# Altium schematic sheet ORD_FV1_2.SchDoc
size 420 x 297 mm; Address1: Address1; Address2: Address2; Address3: Address3; Address4: Address4; DocumentNumber: АБВГ.123456.001 Э3; SheetNumber: 1; Scale: 1:1; DocumentType: Схема электрическая принципиальная; FirstReferrence: АБВГ.123456.001
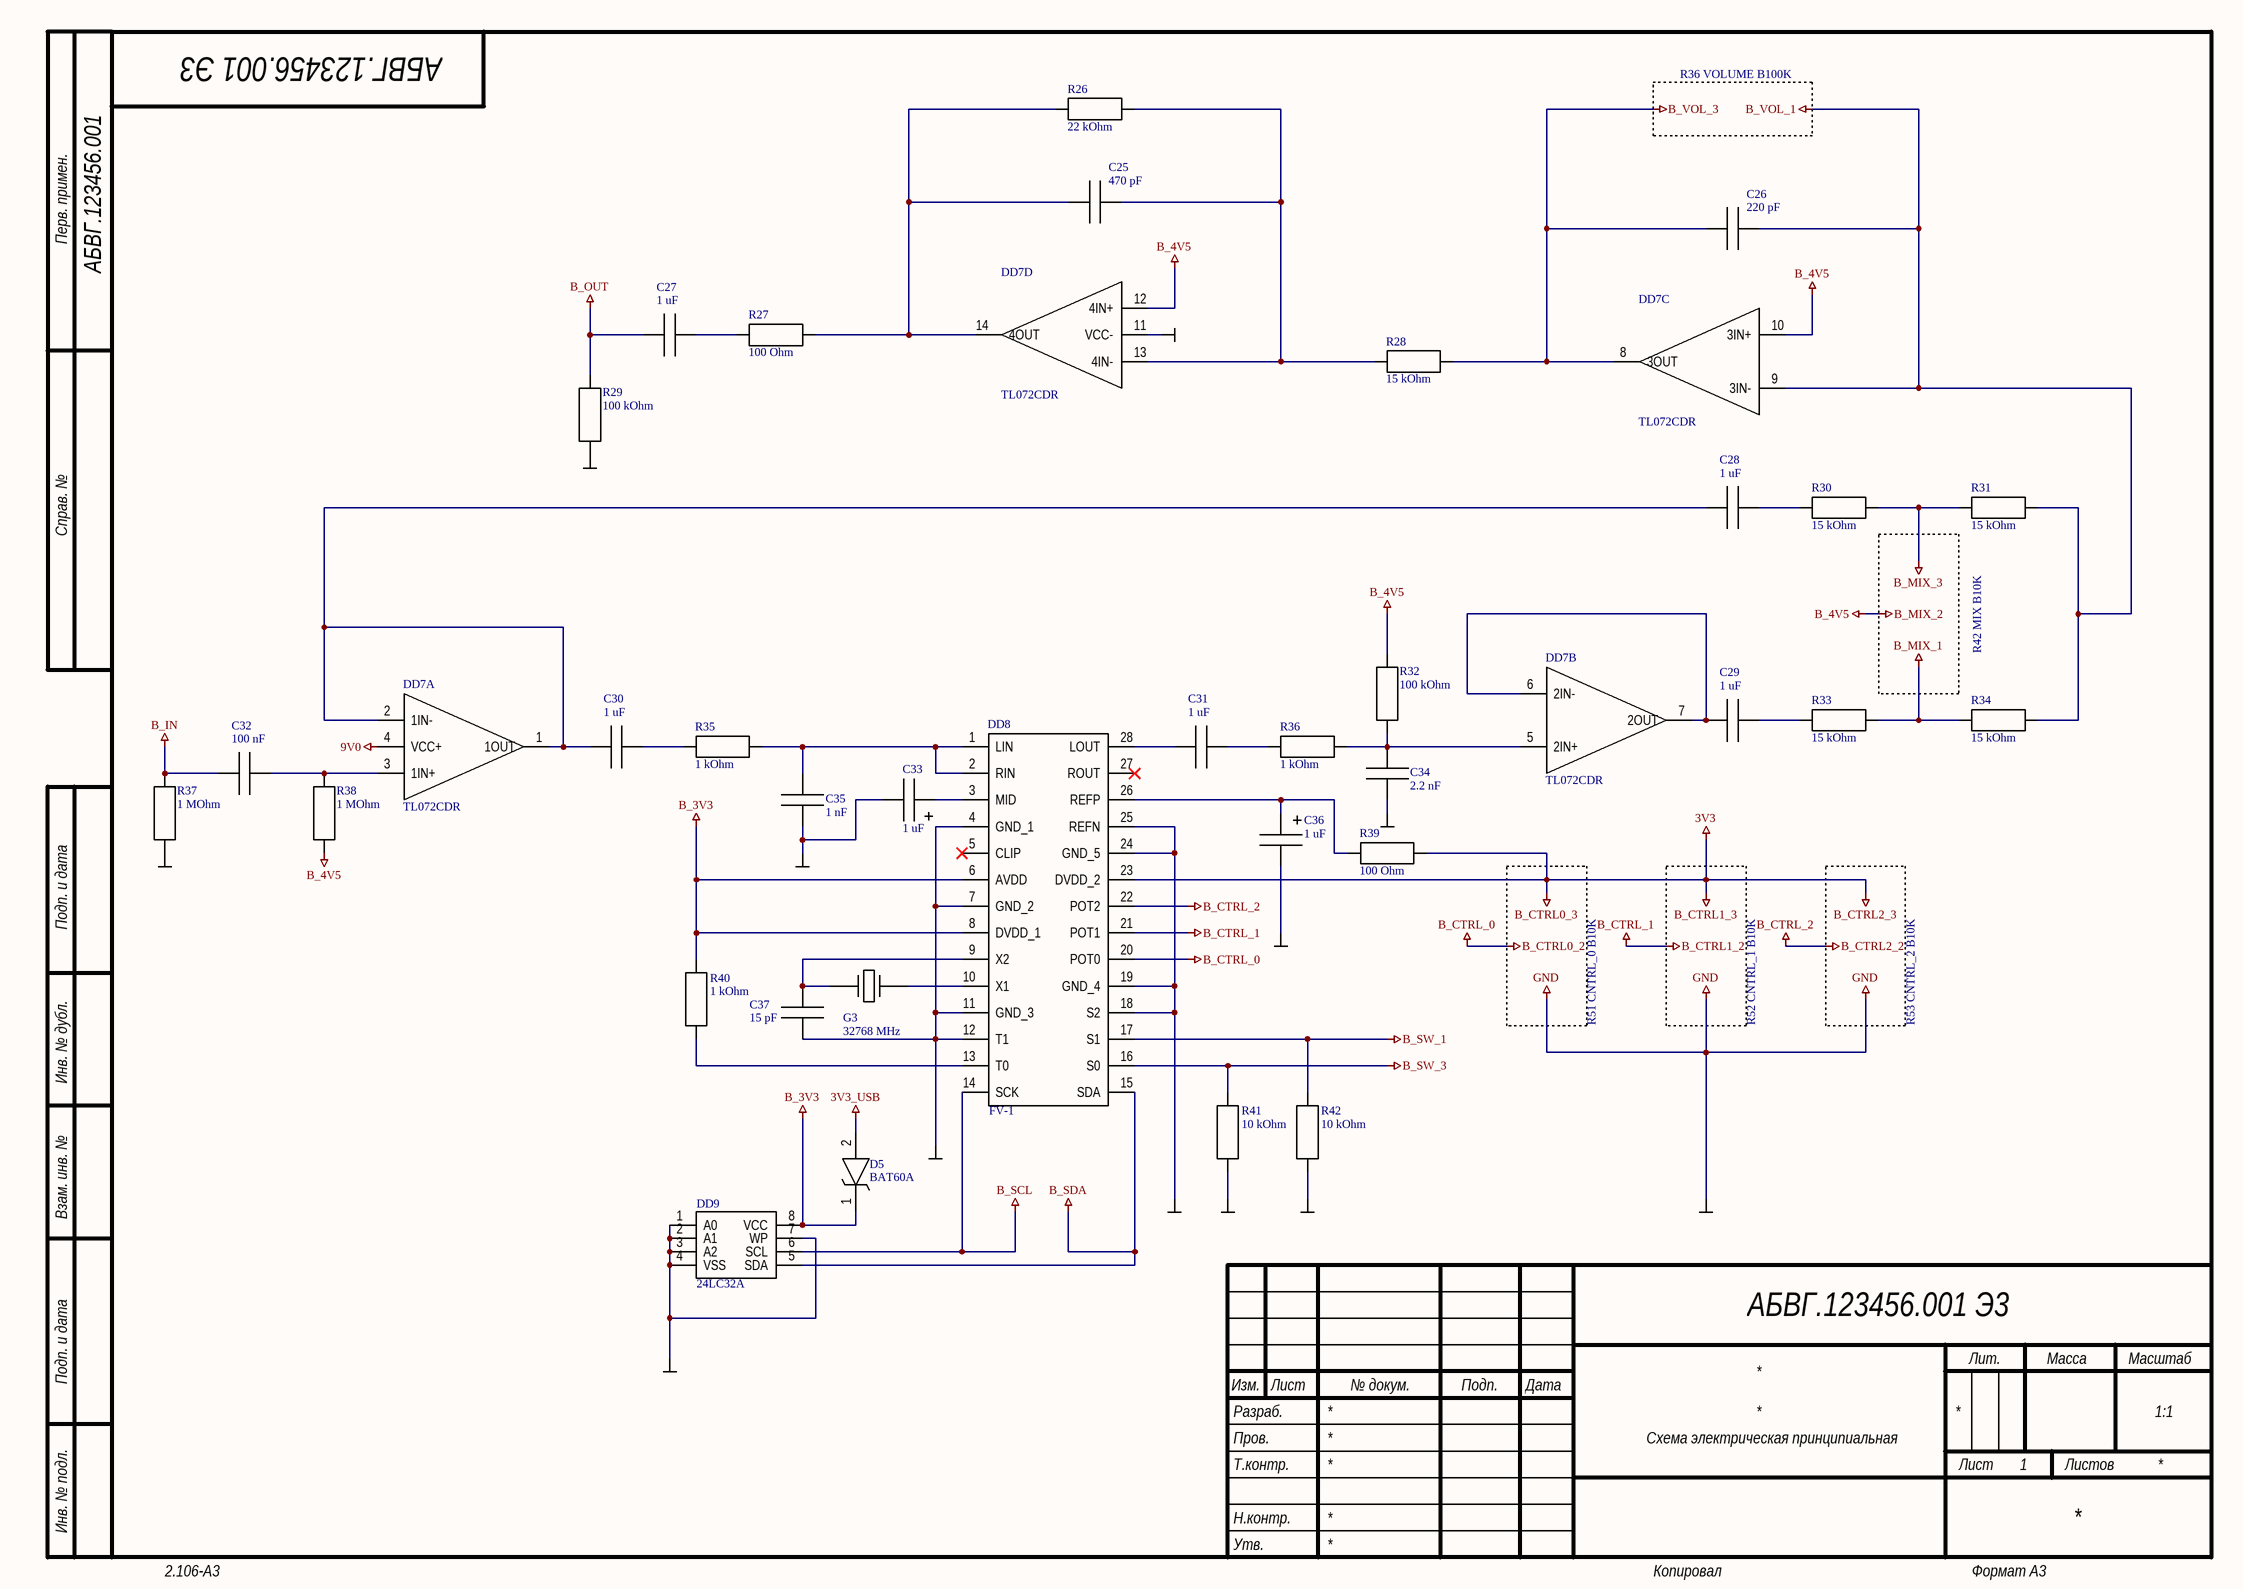
[diagram p0: ORD_FV1_2.SchDoc]

## Parts
C25  470 pF  [C0805[2012]]
C26  220 pF  [C0805[2012]]
C27  1 uF  [C0805[2012]]
C28  1 uF  [C0805[2012]]
C29  1 uF  [C0805[2012]]
C30  1 uF  [C0805[2012]]
C31  1 uF  [C0805[2012]]
C32  100 nF  [C0805[2012]]
C33  1 uF  [C3216_CASE-A]
C34  2.2 nF  [C0805[2012]]
C35  1 nF  [C0805[2012]]
C36  1 uF  [C3216_CASE-A]
C37  15 pF  [C0805[2012]]
D5  BAT60A  [SOD323]
DD7  TL072CDR  [SO14]  (parts A,B,C,D of 4)
DD8  FV-1  [SOIC28]
DD9  24LC32A  [DIP8_WITH_SOCKET]
G3  32768 MHz  [HC-49]
R26  22 kOhm  [R0805[2012]]
R27  100 Ohm  [R0805[2012]]
R28  15 kOhm  [R0805[2012]]
R29  100 kOhm  [R0805[2012]]
R30  15 kOhm  [R0805[2012]]
R31  15 kOhm  [R0805[2012]]
R32  100 kOhm  [R0805[2012]]
R33  15 kOhm  [R0805[2012]]
R34  15 kOhm  [R0805[2012]]
R35  1 kOhm  [R0805[2012]]
R36  1 kOhm  [R0805[2012]]
R37  1 MOhm  [R0805[2012]]
R38  1 MOhm  [R0805[2012]]
R39  100 Ohm  [R0805[2012]]
R40  1 kOhm  [R0805[2012]]
R41  10 kOhm  [R0805[2012]]
R42  10 kOhm  [R0805[2012]]

## Nets
3V3: DD8.23(DVDD_2) R39.1  [also labelled B_CTRL0_3, B_CTRL1_3, B_CTRL2_3]
3V3_USB: D5.2(A)
9V0: DD7.4(VCC+)
B_3V3: D5.1(K) DD8.6(AVDD) DD8.8(DVDD_1) DD9.8(VCC) R40.2
B_4V5: DD7.10(3IN+) DD7.12(4IN+) R32.1 R38.1  [also labelled B_MIX_2]
B_CTRL0_2: DD8.20(POT0)  [also labelled B_CTRL_0]
B_CTRL1_2: DD8.21(POT1)  [also labelled B_CTRL_1]
B_CTRL2_2: DD8.22(POT2)  [also labelled B_CTRL_2]
B_IN: C32.1 R37.2
B_MIX_1: R33.1 R34.2
B_MIX_3: R30.1 R31.2
B_OUT: C27.1 R29.2
B_SCL: DD8.14(SCK) DD9.6(SCL)
B_SDA: DD8.15(SDA) DD9.5(SDA)
B_SW_1: DD8.17(S1) R42.2
B_SW_3: DD8.16(S0) R41.2
B_VOL_1: C26.2 DD7.9(3IN-) R31.1 R34.1
B_VOL_3: C26.1 DD7.8(3OUT) R28.1
GND: C33.2 C34.1 C35.1 C36.2 C37.2 DD7.11(VCC-) DD8.4(GND_1) DD8.7(GND_2) DD8.11(GND_3) DD8.12(T1) DD8.18(S2) DD8.19(GND_4) DD8.24(GND_5) DD8.25(REFN) DD9.1(A0) DD9.2(A1) DD9.3(A2) DD9.4(VSS) DD9.7(WP) R29.1 R37.1 R41.1 R42.1
NetC25_1: C25.1 DD7.14(4OUT) R26.2 R27.1
NetC25_2: C25.2 DD7.13(4IN-) R26.1 R28.2
NetC27_2: C27.2 R27.2
NetC28_1: C28.1 C30.1 DD7.1(1OUT) DD7.2(1IN-)
NetC28_2: C28.2 R30.2
NetC29_1: C29.1 DD7.6(2IN-) DD7.7(2OUT)
NetC29_2: C29.2 R33.2
NetC30_2: C30.2 R35.2
NetC31_1: C31.1 DD8.28(LOUT)
NetC31_2: C31.2 R36.2
NetC32_2: C32.2 DD7.3(1IN+) R38.2
NetC33_1: C33.1 DD8.3(MID)
NetC34_2: C34.2 DD7.5(2IN+) R32.2 R36.1
NetC35_2: C35.2 DD8.1(LIN) DD8.2(RIN) R35.1
NetC36_1: C36.1 DD8.26(REFP) R39.2
NetC37_1: C37.1 DD8.9(X2) G3.1
NetDD8_10: DD8.10(X1) G3.2
NetDD8_13: DD8.13(T0) R40.1

Not connected (* = marked no-connect by the designer): DD8 5(CLIP)* 27(ROUT)*

## Notes on the sheet
- R36 VOLUME B100K
- R42 MIX B10K
- R51 CNTRL_0 B10K
- R52 CNTRL_1 B10K
- R53 CNTRL_2 B10K
- Перв. примен.
- Справ. №
- Подп. и дата
- Инв. № дубл.
- Взам. инв. №
- Разраб.
- Изм.
- Лист
- № докум.
- Подп.
- Дата
- Лит.
- Масса
- Масштаб
- Пров.
- Т.контр.
- Листов
- Инв. № подл.
- Утв.
- Н.контр.
- 2.106-A3
- Копировал
- Формат А3

## Library data of the parts
C25-C32 C34 C35 C37 = Capacitor: Manufacture: *; ManufacturerPartNumber: *; Power/Voltage: *; Quantity: *; Rem: *; TKE: *; Tolerance: *; Корпус: *; Примечание: *
  C25: Value: 470 pF
  C26: Value: 220 pF
  C27-C31: Value: 1 uF
  C32: Value: 100 nF
  C34: Value: 2.2 nF
  C35: Value: 1 nF
  C37: Value: 15 pF
C33 C36 = Capacitor_Pol: Manufacture: *; ManufacturerPartNumber: *; Power/Voltage: *; Quantity: *; Rem: *; TKE: *; Tolerance: *; Value: 1 uF; Корпус: *; Примечание: *
D5 = BAT60A: Diode Schottky 10V 3A Automotive 2-Pin SOD-323 T/R; Manufacturer_Part_Number: BAT60A; Arrow Part Number: BAT60A
DD7 = TL074CDT: TL072CDR, Dual Operational Amplifier 4 MHz -18 to 18V, 8-Pin SO; Manufacturer_Name: STMicroelectronics; Manufacturer_Part_Number: LM358DT; Allied_Number: 70013708; Geometry.Height: 1.75mm; Mouser Part Number: 511-LM358DT; Mouser Price/Stock: https://www.mouser.com/Search/Refine.aspx?Keyword=511-LM358DT; RS Part Number: 7140827P; RS Price/Stock: http://uk.rs-online.com/web/p/products/7140827P; Allied Price/Stock: http://www.alliedelec.com/stmicroelectronics-lm358dt/70013708/; Datasheet Link: http://www.st.com/st-web-ui/static/active/en/resource/technical/document/datasheet/CD00000464.pdf
DD8 = FV-1: FV-1 Reverb IC, Integrated Stereo ADC & DAC, Integrated Circuit, SOIC-28 300 MIL; Manufacturer_Name: Spin Semiconductor; Geometry.Height: 2.51mm; Manufacturer_Part_Number: FV-1 Reverb IC; Mouser Part Number: *; Mouser Price/Stock: *; RS Part Number: *; RS Price/Stock: *; Datasheet Link: http://www.spinsemi.com/Products/datasheets/spn1001/FV-1.pdf
DD9 = 24LC32A: 32K I2C Serial EEPROM with Quarter-Array Write-Protect; Manufacturer_Name: Microchip; Manufacturer_Part_Number: 24LC32AF-I/P; Allied_Number: 70570177; Mouser Part Number: 579-24LC32AF-I/P; Mouser Price/Stock: https://www.mouser.com/Search/Refine.aspx?Keyword=579-24LC32AF-I%2FP; RS Part Number: *; RS Price/Stock: *; Allied Price/Stock: https://www.alliedelec.com/microchip-technology-inc-24lc32af-i-p/70570177/; Datasheet Link: *
G3 = Crystal_2pin: Value: *
R26-R42 = Resistor: Manufacture: *; ManufacturerPartNumber: *; Power/Voltage: *; Quantity: *; Rem: *; TKE: *; Tolerance: *; Корпус: *; Примечание: *
  R26: Value: 22 kOhm
  R27 R39: Value: 100 Ohm
  R28 R30 R31 R33 R34: Value: 15 kOhm
  R29 R32: Value: 100 kOhm
  R35 R36 R40: Value: 1 kOhm
  R37 R38: Value: 1 MOhm
  R41 R42: Value: 10 kOhm